# EAGLE design digilent (EAGLE 9.6.2)
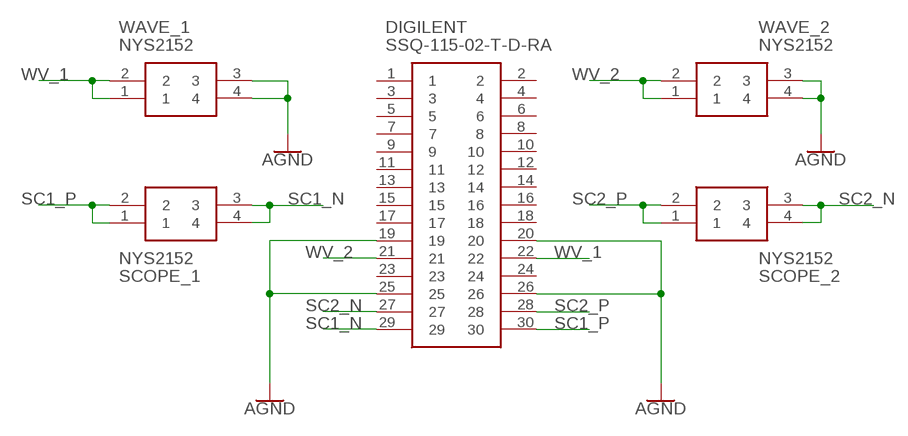
[diagram p0: schematic, sheet 1]

## Parts
DIGILENT  SSQ-115-02-T-D-RA  [RHDRRA30W64P254_2X15_3861X851X]
SCOPE_1  NYS2152  [NYS2152]
SCOPE_2  NYS2152  [NYS2152]
WAVE_1  NYS2152  [NYS2152]
WAVE_2  NYS2152  [NYS2152]

## Nets
AGND: DIGILENT.19 DIGILENT.20 DIGILENT.25 DIGILENT.26 WAVE_1.3 WAVE_1.4 WAVE_2.3 WAVE_2.4
SC1_N: DIGILENT.29 SCOPE_1.3 SCOPE_1.4
SC1_P: DIGILENT.30 SCOPE_1.1 SCOPE_1.2
SC2_N: DIGILENT.27 SCOPE_2.3 SCOPE_2.4
SC2_P: DIGILENT.28 SCOPE_2.1 SCOPE_2.2
WV_1: DIGILENT.22 WAVE_1.1 WAVE_1.2
WV_2: DIGILENT.21 WAVE_2.1 WAVE_2.2
Unconnected: DIGILENT.1 DIGILENT.2 DIGILENT.3 DIGILENT.4 DIGILENT.5 DIGILENT.6 DIGILENT.7 DIGILENT.8 DIGILENT.9 DIGILENT.10 DIGILENT.11 DIGILENT.12 DIGILENT.13 DIGILENT.14 DIGILENT.15 DIGILENT.16 DIGILENT.17 DIGILENT.18 DIGILENT.23 DIGILENT.24

## Library data of the parts
DIGILENT = SamacSys_Parts:SSQ-115-02-T-D-RA: CONN RECEPTACLE, 2.54MM, R/A DUAL 30WAY Source: Datasheet <http://suddendocs.samtec.com/catalog_english/ssq_th.pdf>; DESCRIPTION: CONN RECEPTACLE, 2.54MM, R/A DUAL 30WAY; HEIGHT: 4.95mm; MANUFACTURER_NAME: SAMTEC; MANUFACTURER_PART_NUMBER: SSQ-115-02-T-D-RA; MOUSER_PART_NUMBER: 200-SSQ11502TDRA; MOUSER_PRICE-STOCK: https://www.mouser.co.uk/ProductDetail/Samtec/SSQ-115-02-T-D-RA?qs=rU5fayqh%252BE2UN30xyNQdAQ%3D%3D
SCOPE_1 SCOPE_2 WAVE_1 WAVE_2 = SamacSys_Parts:NYS2152: Phone Connectors 1/4" MONO SWITCHED WITH CHROME NUT REAN Source: Datasheet; DESCRIPTION: Phone Connectors 1/4" MONO SWITCHED WITH CHROME NUT REAN; HEIGHT: 15.85mm; MANUFACTURER_NAME: Neutrik; MANUFACTURER_PART_NUMBER: NYS2152; MOUSER_PART_NUMBER: 568-NYS215/2; MOUSER_PRICE-STOCK: https://www.mouser.co.uk/ProductDetail/REAN/NYS2152?qs=jCymNF74TgWZcUJoC7KZ1g%3D%3D

## Board
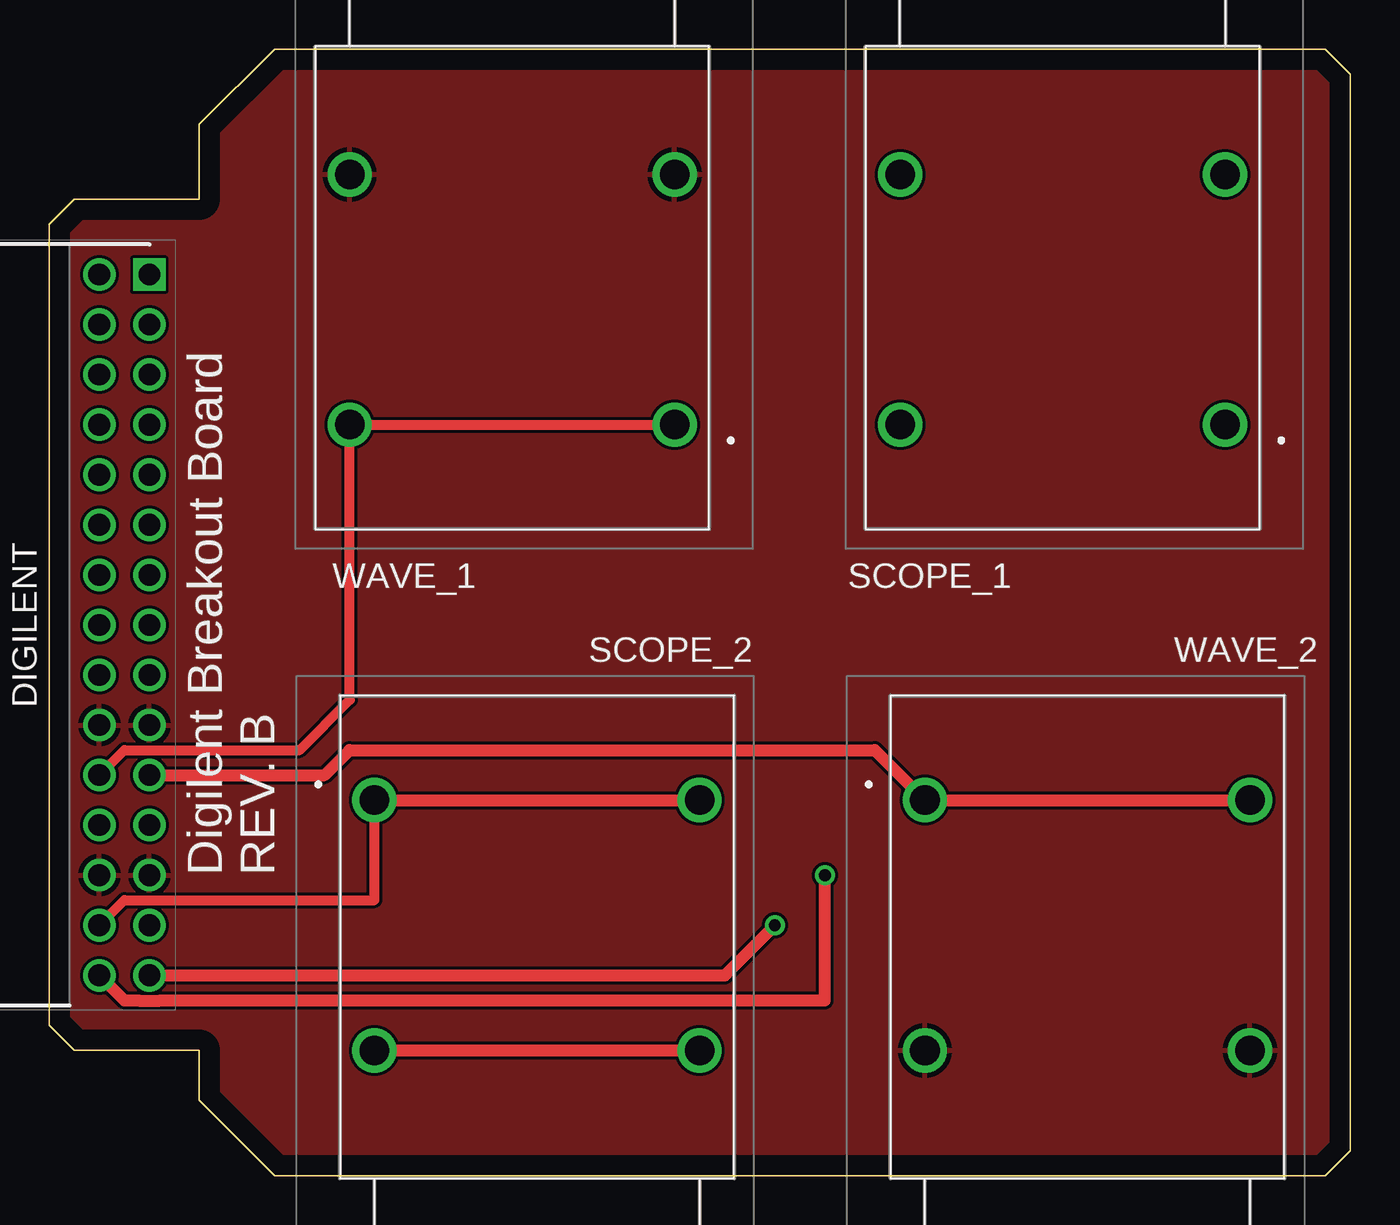
[diagram p1: board, top side]
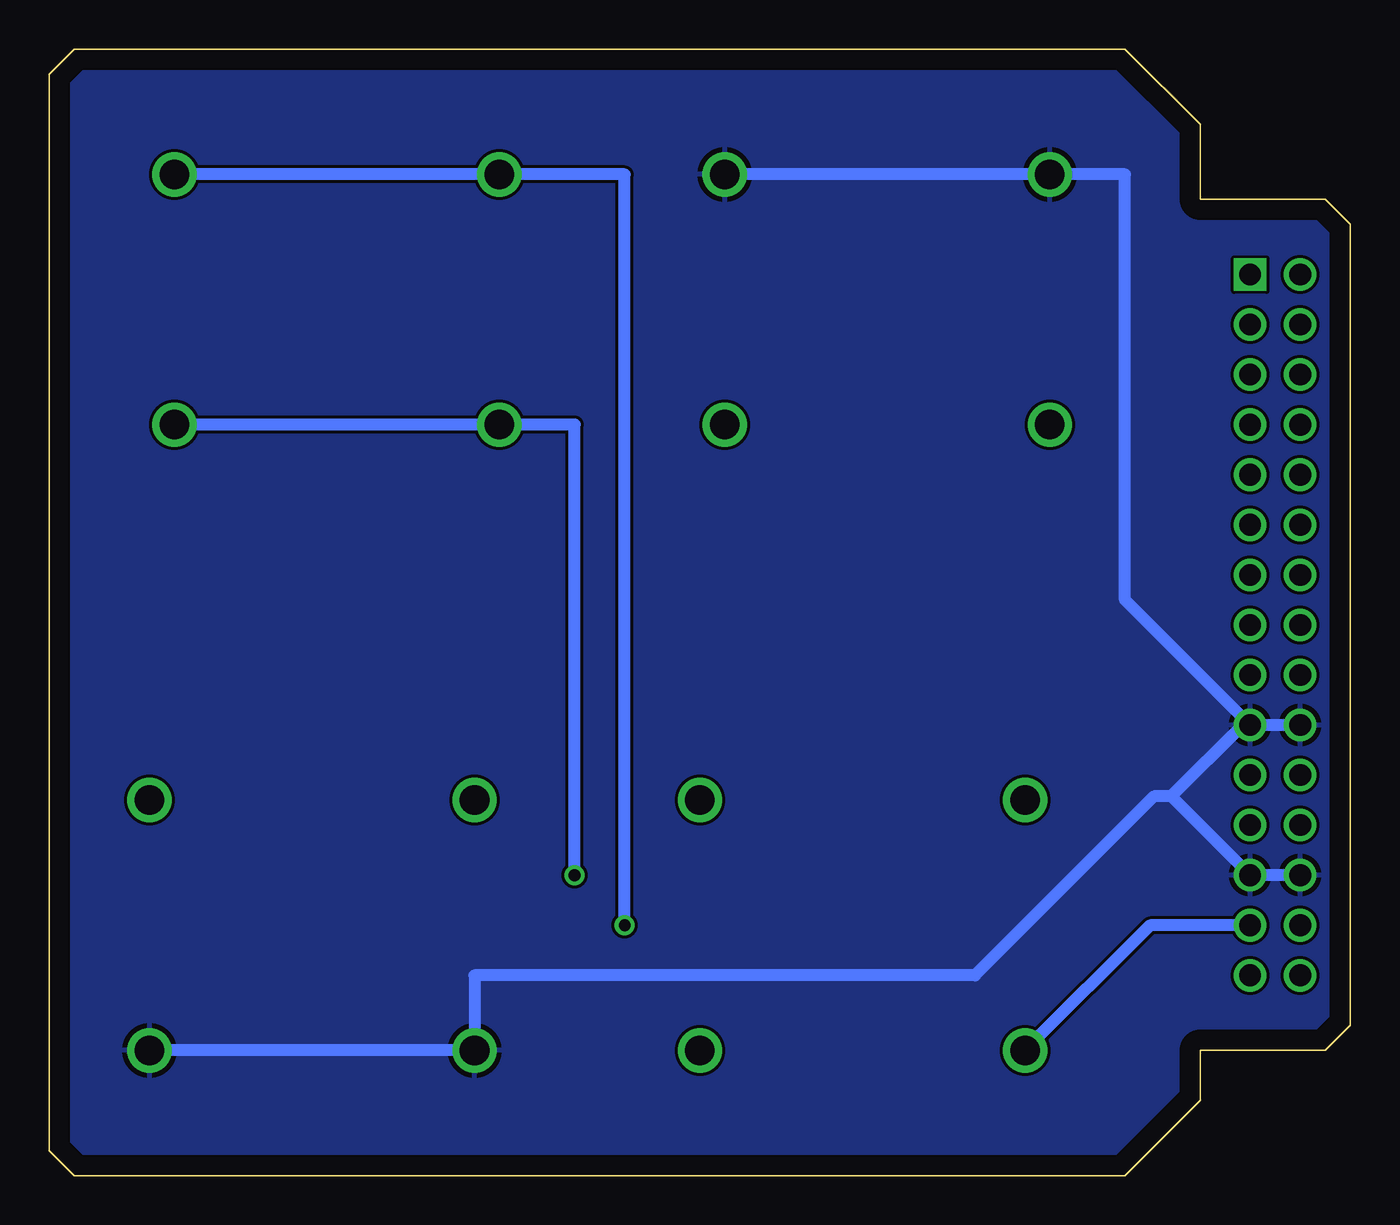
[diagram p2: board, bottom side, seen from below]

Size 66.04 x 57.15 mm. Coordinates in mm from the lower left corner, seen from the top.
Outline: 0,7.62 0,48.26 1.27,49.53 7.62,49.53 7.62,53.34 11.43,57.15 64.77,57.15 66.04,55.88 66.04,1.27 64.77,0 11.43,0 7.62,3.81 7.62,6.35 1.27,6.35 0,7.62
Copper layers (1*16): Top 0.035mm / dielectric 1.5mm / Bottom 0.035mm
Design rules "default": minimum track width 6mil, minimum drill 0.35mm, track to track 6mil, track to pad 6mil, pad to pad 6mil, via to via 6mil, smd to smd 6mil, copper to edge 40mil, drill to drill 6mil, minimum pad ring 10mil, minimum via ring 8mil, stop-mask expansion 4mil, vias tented up to drill 0mil, thermal gap 10mil

### Footprints (pad centres in the part's own frame; a part is rotated, then mirrored left to right if it is on the bottom)
RHDRRA30W64P254_2X15_3861X851X = drill 1.1 pad 1.65 square: 1 0,0 | drill 1.1 pad 1.65: 2 0,2.54; 3 -2.54,0; 4 -2.54,2.54; 5 -5.08,0; 6 -5.08,2.54; 7 -7.62,0; 8 -7.62,2.54; 9 -10.16,0; 10 -10.16,2.54; 11 -12.7,0; 12 -12.7,2.54; 13 -15.24,0; 14 -15.24,2.54; 15 -17.78,0; 16 -17.78,2.54; 17 -20.32,0; 18 -20.32,2.54; 19 -22.86,0; 20 -22.86,2.54; 21 -25.4,0; 22 -25.4,2.54; 23 -27.94,0; 24 -27.94,2.54; 25 -30.48,0; 26 -30.48,2.54; 27 -33.02,0; 28 -33.02,2.54; 29 -35.56,0; 30 -35.56,2.54
NYS2152 = drill 1.5 pad 2.25: 1 0,0; 2 0,16.5; 3 12.7,16.5; 4 12.7,0

### Placement (x,y rotation side)
DIGILENT  5.08,45.72 90 top
SCOPE_1  59.69,38.1 90 top
SCOPE_2  16.51,19.05 270 top
WAVE_1  31.75,38.1 90 top
WAVE_2  44.45,19.05 270 top

### Tracks (layer width: path | path; a pad name or v marks a point on that pad's centre or on a via)
AGND
  Bottom 0.61: WAVE_1.4 WAVE_1.3 11.43,50.8 11.43,29.21 DIGILENT.19 | WAVE_2.3 WAVE_2.4 44.45,10.16 19.05,10.16 9.97,19.24 9.08,19.24 | DIGILENT.20 DIGILENT.19 | DIGILENT.26 DIGILENT.25 9.08,19.24 | DIGILENT.19 5.46,22.86 9.08,19.24
  pour Top: 0,0 66.04,0 66.04,57.15 0,57.15
  pour Bottom: 0,0 66.04,0 66.04,57.15 0,57.15
SC1_N  (via drill 0.6)
  Top 0.61: DIGILENT.29 34.29,10.16 v36.83,12.7
  Bottom 0.61: v36.83,12.7 36.83,50.8 SCOPE_1.3 SCOPE_1.4
SC1_P  (via drill 0.6)
  Top 0.61: DIGILENT.30 3.81,8.89 4.54,8.89 4.55,8.88 5.61,8.88 5.62,8.89 39.37,8.89 v39.37,15.24
  Bottom 0.61: v39.37,15.24 39.37,38.1 SCOPE_1.2 SCOPE_1.1
SC2_N
  Top 0.61: SCOPE_2.4 SCOPE_2.3
  Bottom 0.61: DIGILENT.27 10.16,12.7 SCOPE_2.4
SC2_P
  Top 0.508: DIGILENT.28 3.81,13.97 16.51,13.97 SCOPE_2.1
  Top 0.61: SCOPE_2.1 SCOPE_2.2
WV_1
  Top 0.508: DIGILENT.22 3.81,21.59 12.7,21.59 15.25,24.14 WAVE_1.2 WAVE_1.1
WV_2
  Top 0.61: WAVE_2.2 WAVE_2.1 41.91,21.59 15.24,21.59 13.97,20.32 DIGILENT.21

### Text on the board
tNames: Digilent Breakout Board / REV. B